# Altium schematic sheet Buck_Converters.SchDoc
size A
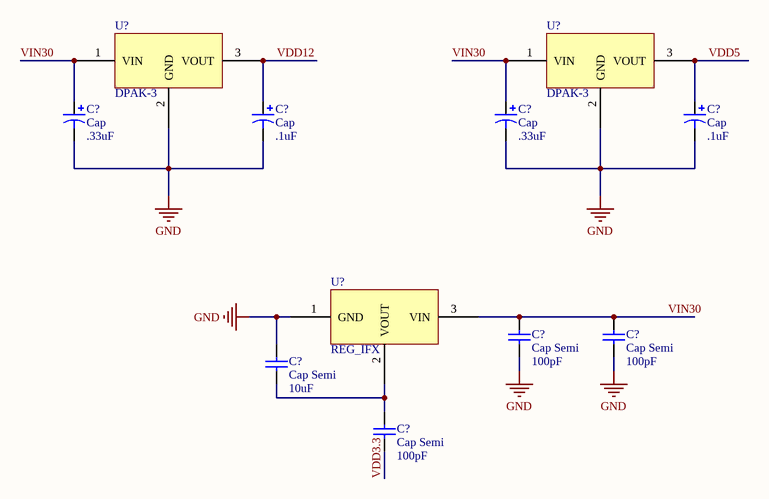
[diagram p0: Buck_Converters.SchDoc]

## Parts
(Parts that share a designator on the sheet are numbered #1, #2 ... from top to bottom, then left to right.)
C?#1  Cap  value .33uF  [C0805]
C?#2  Cap  value .1uF  [C0805]
C?#3  Cap  value .33uF  [C0805]
C?#4  Cap  value .1uF  [C0805]
C?#5  Cap Semi  value 100pF  [C1206]
C?#6  Cap Semi  value 100pF  [C1206]
C?#7  Cap Semi  value 10uF  [C1206]
C?#8  Cap Semi  value 100pF  [C1206]
U?#1  DPAK-3  [DPAK-3]
U?#2  DPAK-3  [DPAK-3]
U?#3  REG_IFX  [Reg_IFX]

## Nets
GND: C?#1.2 C?#2.2 C?#3.2 C?#4.2 C?#5.1 C?#6.1 C?#7.2 U?#1.2(GND) U?#2.2(GND) U?#3.1(GND)
VDD3.3: C?#8.1
VDD5: C?#4.1 U?#2.3(VOUT)
VDD12: C?#2.1 U?#1.3(VOUT)
VIN30: C?#1.1 C?#3.1 C?#5.2 C?#6.2 U?#1.1(VIN) U?#2.1(VIN) U?#3.3(VIN)
NetC?#7_1: C?#7.1 C?#8.2 U?#3.2(VOUT)

## Library data of the parts
C?#1-C?#4 = Cap Pol3: Polarized Capacitor (Surface Mount); Published: 8-Jun-2000; LatestRevisionDate: 29-May-2009; LatestRevisionNote: IPC-7351 Footprint Added.; PackageReference: C0805; Publisher: Altium Limited; PackageDescription: Chip Capacitor
C?#5-C?#8 = Cap Semi: Capacitor (Semiconductor SIM Model); Published: 8-Jun-2000; LatestRevisionDate: 29-May-2009; LatestRevisionNote: IPC-7351 Footprint Added.; PackageReference: C1206; Publisher: Altium Limited; PackageDescription: Chip Capacitor